# Altium schematic sheet Feedback.SchDoc
size A4
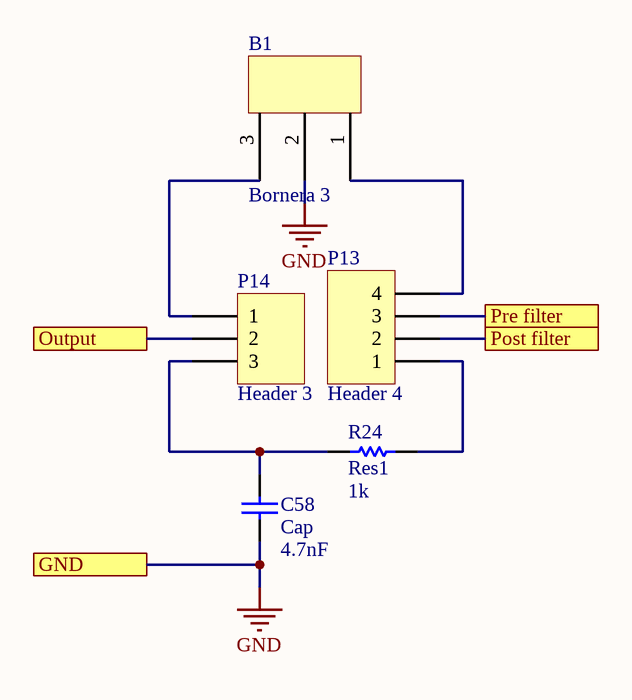
[diagram p0: Feedback.SchDoc]

## Parts
B1  Bornera 3  [bornera 3]
C58  Cap  value 4.7nF  [CAP DISCO 200mil]
P13  Header 4  [HDR1X4]
P14  Header 3  [HDR1X3]
R24  Res1  value 1k  [1206 resistor]

## Ports
GND, Output, Post filter, Pre filter

## Nets
GND: B1.2(L) C58.1 ; port GND
Output: P14.2 ; port Output
Post filter: P13.2 ; port Post filter
Pre filter: P13.3 ; port Pre filter
NetB1_1: B1.1(L) P13.4
NetB1_3: B1.3(L) P14.1
NetC58_2: C58.2 P14.3 R24.2
NetP13_1: P13.1 R24.1

## Library data of the parts
C58 = Cap: Capacitor; Published: 8-Jun-2000; LatestRevisionDate: 17-Jul-2002; LatestRevisionNote: Re-released for DXP Platform.; PackageReference: RAD-0.3; Publisher: Altium Limited; PackageDescription: Radial Cap, Thru-Hole; 2 Leads; 0.3 in Pin Spacing
P13 = Header 4: Header, 4-Pin; LatestRevisionDate: 17-Jul-2002; LatestRevisionNote: Re-released for DXP Platform.; Publisher: Altium Limited
P14 = Header 3: Header, 3-Pin; LatestRevisionDate: 17-Jul-2002; LatestRevisionNote: Re-released for DXP Platform.; Publisher: Altium Limited
R24 = Res1: Resistor; Published: 8-Jun-2000; LatestRevisionDate: 17-Jul-2002; LatestRevisionNote: Re-released for DXP Platform.; PackageReference: AXIAL-0.3; Publisher: Altium Limited; PackageDescription: Axial Device, Thru-Hole; 2 Leads; 0.3 in Pin Spacing